# EAGLE design z8530-rs422-b (EAGLE 9.2.2)
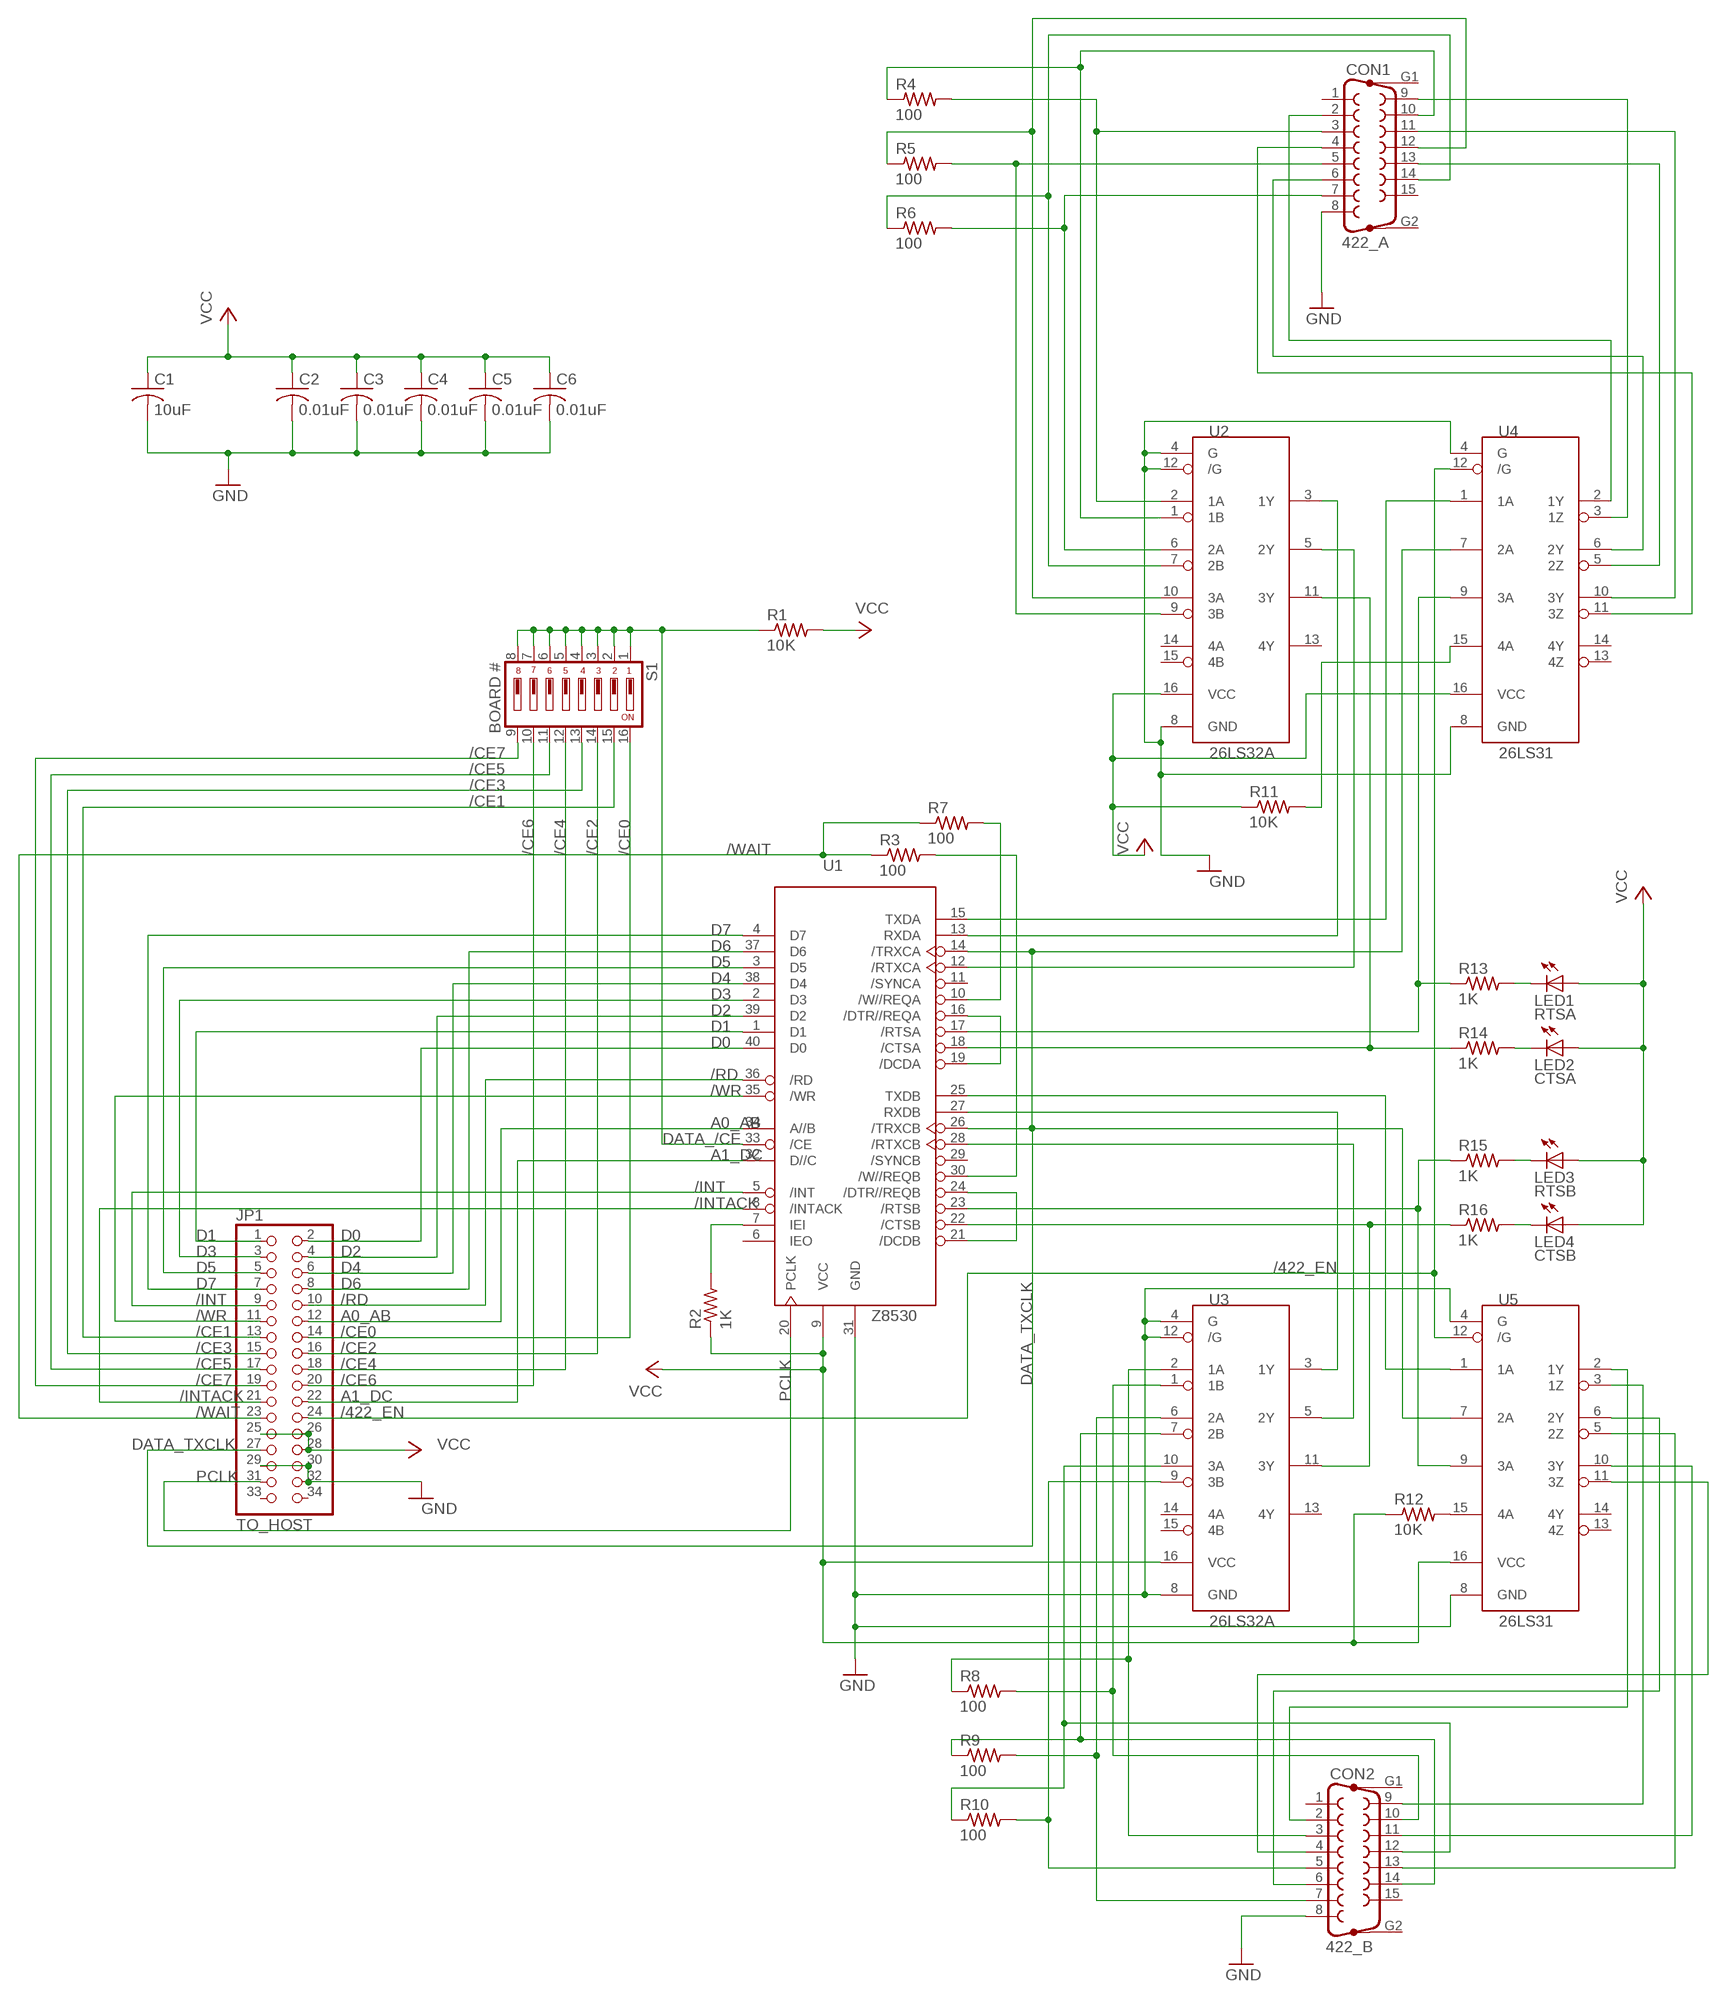
[diagram p0: schematic, sheet 1]

## Parts
C1  10uF  C-USC0805  [C0805]
C2  0.01uF  C-USC0805  [C0805]
C3  0.01uF  C-USC0805  [C0805]
C4  0.01uF  C-USC0805  [C0805]
C5  0.01uF  C-USC0805  [C0805]
C6  0.01uF  C-USC0805  [C0805]
CON1  422_A  F15VP  [F15VP]
CON2  422_B  F15VP  [F15VP]
JP1  TO_HOST  PINHD-2X17  [2X17]
LED1  RTSA  LED3MM  [LED3MM]
LED2  CTSA  LED3MM  [LED3MM]
LED3  RTSB  LED3MM  [LED3MM]
LED4  CTSB  LED3MM  [LED3MM]
R1  10K  R-US_R0805  [R0805]
R2  1K  R-US_R0805  [R0805]
R3  100  R-US_R0805  [R0805]
R4  100  R-US_R0805  [R0805]
R5  100  R-US_R0805  [R0805]
R6  100  R-US_R0805  [R0805]
R7  100  R-US_R0805  [R0805]
R8  100  R-US_R0805  [R0805]
R9  100  R-US_R0805  [R0805]
R10  100  R-US_R0805  [R0805]
R11  10K  R-US_R0805  [R0805]
R12  10K  R-US_R0805  [R0805]
R13  1K  R-US_R0805  [R0805]
R14  1K  R-US_R0805  [R0805]
R15  1K  R-US_R0805  [R0805]
R16  1K  R-US_R0805  [R0805]
S1  BOARD #  DP08  [DP-08]
U1  Z8530  Z8530PDIP40  [DIL40]
U2  26LS32A  AM26LS32APDIP16  [DIP16]
U3  26LS32A  AM26LS32APDIP16  [DIP16]
U4  26LS31  AM26L31  [DIP16]
U5  26LS31  AM26L31  [DIP16]

## Nets
/422_EN: JP1.24 U4.12(/G) U5.12(/G)
/CE0: JP1.14 S1.16
/CE1: JP1.13 S1.15
/CE2: JP1.16 S1.14
/CE3: JP1.15 S1.13
/CE4: JP1.18 S1.12
/CE5: JP1.17 S1.11
/CE6: JP1.20 S1.10
/CE7: JP1.19 S1.9
/INT: JP1.9 U1.5(/INT)
/INTACK: JP1.21 U1.8(/INTACK)
/RD: JP1.10 U1.36(/RD)
/WAIT: JP1.23 R3.1 R7.1
/WR: JP1.11 U1.35(/WR)
A0_AB: JP1.12 U1.34(A//B)
A1_DC: JP1.22 U1.32(D//C)
D0: JP1.2 U1.40(D0)
D1: JP1.1 U1.1(D1)
D2: JP1.4 U1.39(D2)
D3: JP1.3 U1.2(D3)
D4: JP1.6 U1.38(D4)
D5: JP1.5 U1.3(D5)
D6: JP1.8 U1.37(D6)
D7: JP1.7 U1.4(D7)
DATA_/CE: R1.1 S1.1 S1.2 S1.3 S1.4 S1.5 S1.6 S1.7 S1.8 U1.33(/CE)
DATA_TXCLK: JP1.27 U1.14(/TRXCA) U1.26(/TRXCB) U4.7(2A) U5.7(2A)
GND [gnd]: C1.2 C2.2 C3.2 C4.2 C5.2 C6.2 CON1.8 CON2.8 JP1.29 JP1.30 JP1.32 U1.31(GND) U2.4(G) U2.8(GND) U2.12(/G) U3.4(G) U3.8(GND) U3.12(/G) U4.4(G) U4.8(GND) U5.4(G) U5.8(GND)
N$7: R7.2 U1.10(/W//REQA)
N$8: R3.2 U1.30(/W//REQB)
N$11: U1.13(RXDA) U2.3(1Y)
N$12: U1.12(/RTXCA) U2.5(2Y)
N$13: R14.1 U1.18(/CTSA) U2.11(3Y)
N$14: U1.15(TXDA) U4.1(1A)
N$16: R13.1 U1.17(/RTSA) U4.9(3A)
N$17: U1.16(/DTR//REQA) U1.19(/DCDA)
N$18: U1.21(/DCDB) U1.24(/DTR//REQB)
N$19: U1.27(RXDB) U3.3(1Y)
N$20: U1.28(/RTXCB) U3.5(2Y)
N$21: R16.1 U1.22(/CTSB) U3.11(3Y)
N$22: U1.25(TXDB) U5.1(1A)
N$24: R15.1 U1.23(/RTSB) U5.9(3A)
N$26: CON1.3 R4.2 U2.2(1A)
N$27: CON1.10 R4.1 U2.1(1B)
N$28: CON1.7 R6.2 U2.6(2A)
N$29: CON1.14 R6.1 U2.7(2B)
N$30: CON1.12 R5.1 U2.10(3A)
N$31: CON1.5 R5.2 U2.9(3B)
N$32: CON1.2 U4.2(1Y)
N$33: CON1.9 U4.3(1Z)
N$34: CON1.6 U4.6(2Y)
N$35: CON1.13 U4.5(2Z)
N$36: CON1.11 U4.10(3Y)
N$37: CON1.4 U4.11(3Z)
N$40: CON2.3 R8.1 U3.2(1A)
N$41: CON2.10 R8.2 U3.1(1B)
N$42: CON2.7 R9.2 U3.6(2A)
N$43: CON2.14 R9.1 U3.7(2B)
N$44: CON2.12 R10.1 U3.10(3A)
N$45: CON2.5 R10.2 U3.9(3B)
N$46: CON2.2 U5.2(1Y)
N$47: CON2.9 U5.3(1Z)
N$48: CON2.6 U5.6(2Y)
N$49: CON2.13 U5.5(2Z)
N$50: CON2.11 U5.10(3Y)
N$51: CON2.4 U5.11(3Z)
N$56: LED1.K(C) R13.2
N$57: LED3.K(C) R15.2
N$58: LED2.K(C) R14.2
N$59: LED4.K(C) R16.2
N$60: R2.2 U1.7(IEI)
N$62: R11.2 U4.15(4A)
N$63: R12.2 U5.15(4A)
PCLK: JP1.31 U1.20(PCLK)
VCC [5Vpwr]: C1.1 C2.1 C3.1 C4.1 C5.1 C6.1 JP1.25 JP1.26 JP1.28 LED1.A LED2.A LED3.A LED4.A R1.2 R2.1 R11.1 R12.1 U1.9(VCC) U2.16(VCC) U3.16(VCC) U4.16(VCC) U5.16(VCC)
Unconnected: CON1.1 CON1.15 CON1.G1 CON1.G2 CON2.1 CON2.15 CON2.G1 CON2.G2 JP1.33 JP1.34 U1.6(IEO) U1.11(/SYNCA) U1.29(/SYNCB) U2.13(4Y) U2.14(4A) U2.15(4B) U3.13(4Y) U3.14(4A) U3.15(4B) U4.13(4Z) U4.14(4Y) U5.13(4Z) U5.14(4Y)

## Library data of the parts
C1-C6 = rcl:C-US: CAPACITOR, American symbol; SPICEPREFIX: C
CON1 CON2 = con-subd:F15VP: SUB-D; OC_FARNELL: unknown; OC_NEWARK: unknown
JP1 = pinhead:PINHD-2X17: PIN HEADER
LED1-LED4 = led:LED: LED OSRAM: - CHIPLED LG R971, LG N971, LY N971, LG Q971, LY Q971, LO R971, LY R971 LH N974, LH R974 LS Q976, LO Q976, LY Q976 LO Q996 - Hyper CHIPLED LW Q18S LB Q993, LB Q99A, LB R99A - SideLED LS A670, LO A670, LY A670, LG A670, LP A670 LB A673, LV A673, LT A673, LW A673 LH A674 LY A675 LS A676, LA A676, LO A676, LY A676, LW A676 LS A679, LY A679, LG A679 - Hyper Micro SIDELED® LS Y876, LA Y876, LO Y876, LY Y876 LT Y87S - SmartLED LW L88C, LW L88S LB L89C, LB L89S, LG L890 LS L89K, LO L89K, LY L89K LS L896, LA L896, LO L896, LY L896 - TOPLED LS T670, LO T670, LY T670, LG T670, LP T670 LSG T670, LSP T670, LSY T670, LOP T670, LYG T670 LG T671, LOG T671, LSG T671 LB T673, LV T673, LT T673, LW T673 LH T674 LS T676, LA T676, LO T676, LY T676, LB T676, LH T676, LSB T676, LW T676 LB T67C, LV T67C, LT T67C, LS T67K, LO T67K, LY T67K, LW E67C LS E67B, LA E67B, LO E67B, LY E67B, LB E67C, LV E67C, LT E67C LW T67C LS T679, LY T679, LG T679 LS T770, LO T770, LY T770, LG T770, LP T770 LB T773, LV T773, LT T773, LW T773 LH T774 LS E675, LA E675, LY E675, LS T675 LS T776, LA T776, LO T776, LY T776, LB T776 LHGB T686 LT T68C, LB T68C - Hyper Mini TOPLED® LB M676 - Mini TOPLED Santana® LG M470 LS M47K, LO M47K, LY M47K Source: http://www.osram.convergy.de LUXEON: - LUMILED® LXK2-PW12-R00, LXK2-PW12-S00, LXK2-PW14-U00, LXK2-PW14-V00 LXK2-PM12-R00, LXK2-PM12-S00, LXK2-PM14-U00 LXK2-PE12-Q00, LXK2-PE12-R00, LXK2-PE12-S00, LXK2-PE14-T00, LXK2-PE14-U00 LXK2-PB12-K00, LXK2-PB12-L00, LXK2-PB12-M00, LXK2-PB14-N00, LXK2-PB14-P00, LXK2-PB14-Q00 LXK2-PR12-L00, LXK2-PR12-M00, LXK2-PR14-Q00, LXK2-PR14-R00 LXK2-PD12-Q00, LXK2-PD12-R00, LXK2-PD12-S00 LXK2-PH12-R00, LXK2-PH12-S00 LXK2-PL12-P00, LXK2-PL12-Q00, LXK2-PL12-R00 Source: www.luxeon.com KINGBRIGHT: KA-3528ASYC Source: www.kingbright.com
R1-R16 = rcl:R-US_: RESISTOR, American symbol; SPICEPREFIX: R
S1 = switch-dil:DP08: DIL/CODE SWITCH; MPN: DP08; OC_FARNELL: 9471626; OC_NEWARK: 73J0035
U1 = rs422-stuff:Z85*30: Zilog SCC Serial Controller, dual port Synchronous/Asynchronous controller. Data sheet and User manual
U2 U3 = rs422-stuff:AM26LS32A: Texas Instruments Quadruple RS-422/423 Differential Line Receivers Data sheet
U4 U5 = rs422-stuff:AM26L31: Texas Instruments RS-422/423 AM26LS31x Quadruple Differential Line Driver Data sheet

## Net classes
0 default: width 0.254 mm, clearance 0.254 mm
1 3Vpwr: width 0.305 mm, clearance 0.254 mm
2 5Vpwr: width 0.406 mm, clearance 0.254 mm
3 gnd: width 0.508 mm, clearance 0.254 mm

## Board
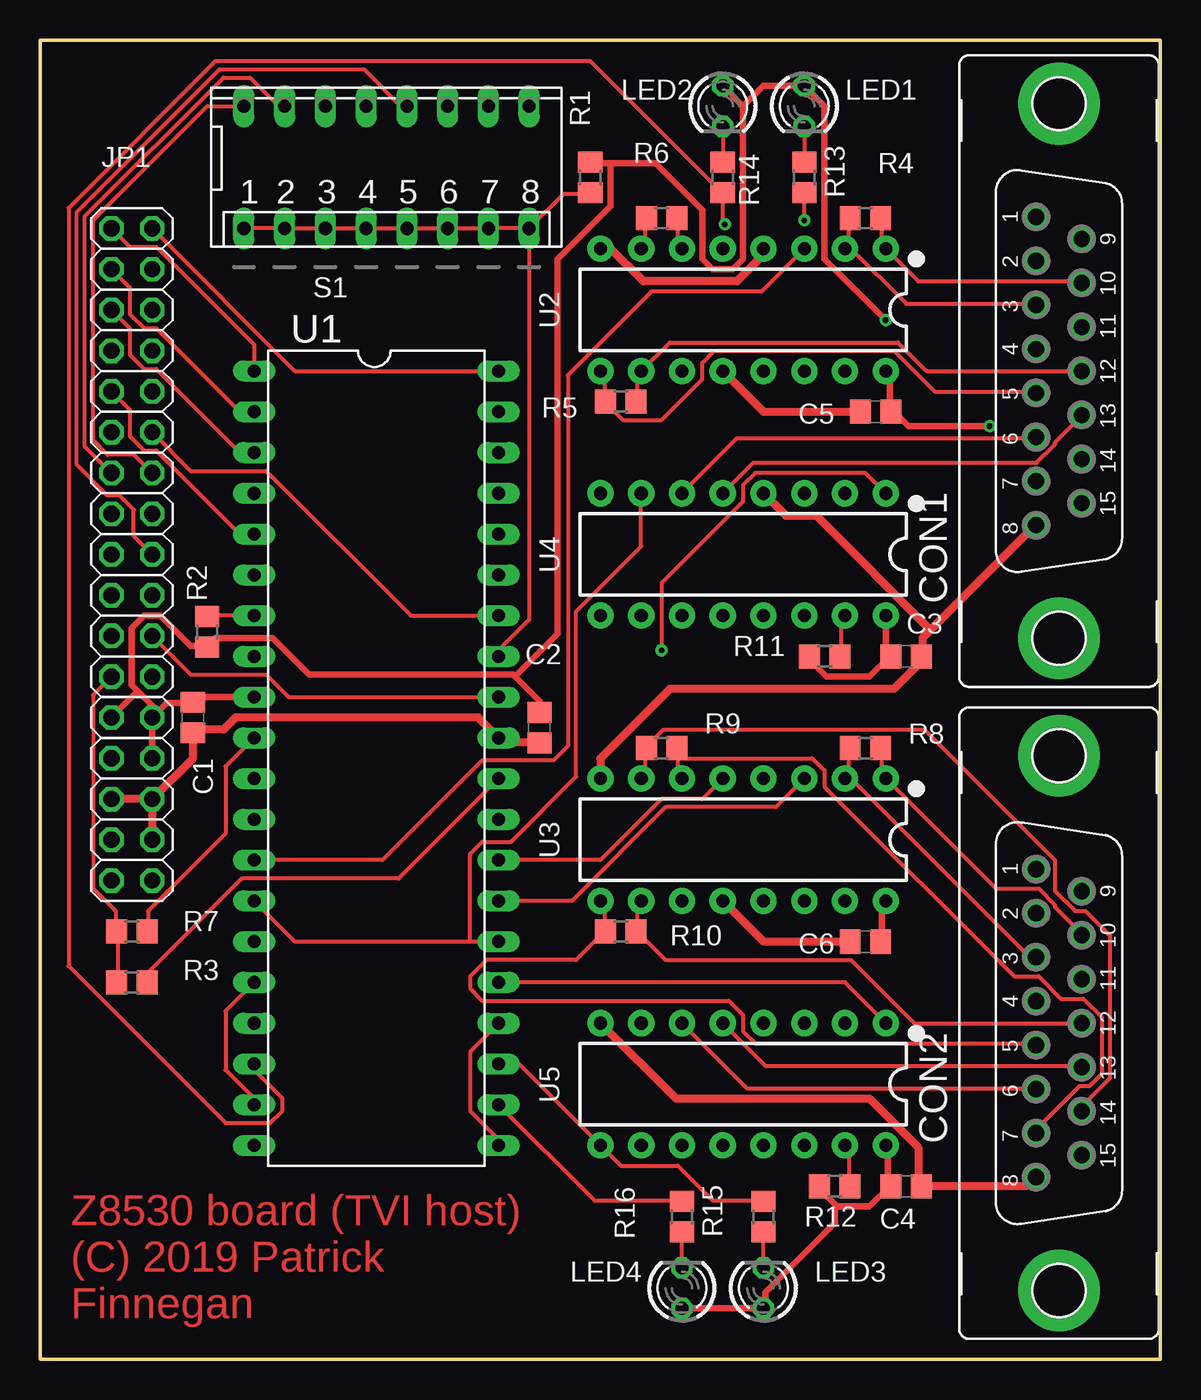
[diagram p1: board, top side]
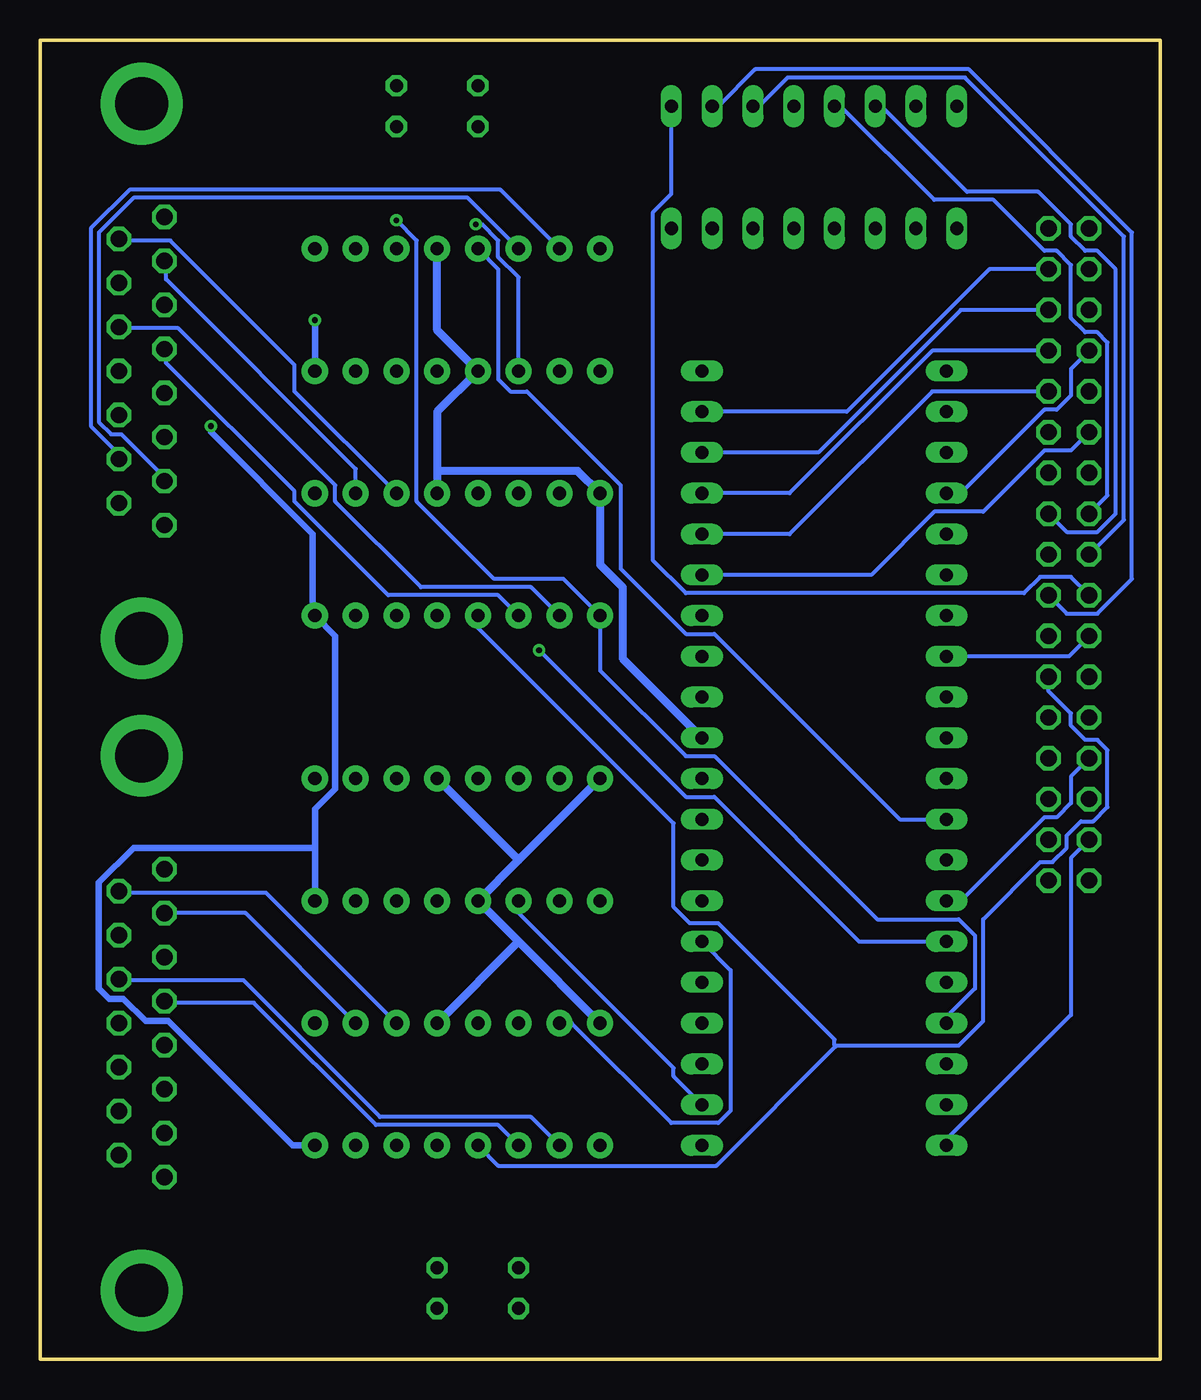
[diagram p2: board, bottom side, seen from below]

Size 69.83 x 82.22 mm. Coordinates in mm from the lower left corner, seen from the top.
Outline: 0,0 69.83,0 69.83,82.22 0,82.22 0,0
Copper layers (1*16): Top 0.035mm / dielectric 1.5mm / Bottom 0.035mm
Design rules "8mil": minimum track width 6mil, minimum drill 0.35mm, track to track 8mil, track to pad 8mil, pad to pad 8mil, via to via 8mil, smd to smd 8mil, copper to edge 40mil, drill to drill 6mil, minimum pad ring 10mil, minimum via ring 8mil, stop-mask expansion 4mil, vias tented up to drill 0mil, thermal gap 10mil

### Footprints (pad centres in the part's own frame; a part is rotated, then mirrored left to right if it is on the bottom)
C0805 = smd 1.3 x 1.5: 1 -0.95,0; 2 0.95,0
F15VP = drill 1.016 octagon: 1 9.601,1.422; 2 6.858,1.422; 3 4.115,1.422; 4 1.372,1.422; 5 -1.372,1.422; 6 -4.115,1.422; 7 -6.858,1.422; 8 -9.601,1.422; 9 8.23,-1.422; 10 5.486,-1.422; 11 2.743,-1.422; 12 0,-1.422; 13 -2.743,-1.422; 14 -5.486,-1.422; 15 -8.23,-1.422 | drill 3.302 pad 5.08: G1 -16.662,0; G2 16.662,0
2X17 = drill 1.016 octagon: 1 -20.32,-1.27; 2 -20.32,1.27; 3 -17.78,-1.27; 4 -17.78,1.27; 5 -15.24,-1.27; 6 -15.24,1.27; 7 -12.7,-1.27; 8 -12.7,1.27; 9 -10.16,-1.27; 10 -10.16,1.27; 11 -7.62,-1.27; 12 -7.62,1.27; 13 -5.08,-1.27; 14 -5.08,1.27; 15 -2.54,-1.27; 16 -2.54,1.27; 17 0,-1.27; 18 0,1.27; 19 2.54,-1.27; 20 2.54,1.27; 21 5.08,-1.27; 22 5.08,1.27; 23 7.62,-1.27; 24 7.62,1.27; 25 10.16,-1.27; 26 10.16,1.27; 27 12.7,-1.27; 28 12.7,1.27; 29 15.24,-1.27; 30 15.24,1.27; 31 17.78,-1.27; 32 17.78,1.27; 33 20.32,-1.27; 34 20.32,1.27
LED3MM = drill 0.813 octagon: A -1.27,0; K 1.27,0
R0805 = smd 1.3 x 1.5: 1 -0.95,0; 2 0.95,0
DP-08 = drill 0.813 long: 1 -8.89,-3.81; 2 -6.35,-3.81; 3 -3.81,-3.81; 4 -1.27,-3.81; 5 1.27,-3.81; 6 3.81,-3.81; 7 6.35,-3.81; 8 8.89,-3.81; 9 8.89,3.81; 10 6.35,3.81; 11 3.81,3.81; 12 1.27,3.81; 13 -1.27,3.81; 14 -3.81,3.81; 15 -6.35,3.81; 16 -8.89,3.81
DIL40 = drill 0.813 long: 1 -24.13,-7.62; 2 -21.59,-7.62; 3 -19.05,-7.62; 4 -16.51,-7.62; 5 -13.97,-7.62; 6 -11.43,-7.62; 7 -8.89,-7.62; 8 -6.35,-7.62; 9 -3.81,-7.62; 10 -1.27,-7.62; 11 1.27,-7.62; 12 3.81,-7.62; 13 6.35,-7.62; 14 8.89,-7.62; 15 11.43,-7.62; 16 13.97,-7.62; 17 16.51,-7.62; 18 19.05,-7.62; 19 21.59,-7.62; 20 24.13,-7.62; 21 24.13,7.62; 22 21.59,7.62; 23 19.05,7.62; 24 16.51,7.62; 25 13.97,7.62; 26 11.43,7.62; 27 8.89,7.62; 28 6.35,7.62; 29 3.81,7.62; 30 1.27,7.62; 31 -1.27,7.62; 32 -3.81,7.62; 33 -6.35,7.62; 34 -8.89,7.62; 35 -11.43,7.62; 36 -13.97,7.62; 37 -16.51,7.62; 38 -19.05,7.62; 39 -21.59,7.62; 40 -24.13,7.62
DIP16 = drill 0.813 pad 1.626: 1 -8.89,-3.81; 2 -6.35,-3.81; 3 -3.81,-3.81; 4 -1.27,-3.81; 5 1.27,-3.81; 6 3.81,-3.81; 7 6.35,-3.81; 8 8.89,-3.81; 9 8.89,3.81; 10 6.35,3.81; 11 3.81,3.81; 12 1.27,3.81; 13 -1.27,3.81; 14 -3.81,3.81; 15 -6.35,3.81; 16 -8.89,3.81

### Placement (x,y rotation side)
C1  9.52,40 270 top
C2  31.11,39.37 270 top
C3  53.97,43.81 0 top
C4  53.97,10.79 0 top
C5  52.07,59.05 180 top
C6  51.44,26.03 180 top
CON1  63.5,61.59 90 top
CON2  63.5,20.95 90 top
JP1  5.72,50.16 270 top
LED1  47.62,78.11 270 top
LED2  42.55,78.11 270 top
LED3  45.08,4.45 90 top
LED4  40,4.45 90 top
R1  34.29,73.66 90 top
R2  10.41,45.34 90 top
R3  5.72,23.49 0 top
R4  51.44,71.12 180 top
R5  36.19,59.69 180 top
R6  38.73,71.12 0 top
R7  5.72,26.67 0 top
R8  51.44,38.1 0 top
R9  38.73,38.1 0 top
R10  36.19,26.67 180 top
R11  48.89,43.81 0 top
R12  49.53,10.79 0 top
R13  47.62,73.66 90 top
R14  42.55,73.66 90 top
R15  45.08,8.89 270 top
R16  40,8.89 270 top
S1  21.59,74.3 0 top
U1  20.95,37.46 270 top
U2  43.81,65.41 180 top
U3  43.81,32.38 180 top
U4  43.81,50.16 180 top
U5  43.81,17.15 180 top

### Tracks (layer width: path | path; a pad name or v marks a point on that pad's centre or on a via)
/422_EN
  Bottom 0.254: JP1.24 6.98,41.66 5.59,40.26 5.59,39.5 4.7,38.61 3.94,38.61 3.3,37.97 3.3,34.42 4.19,33.53 4.95,33.53 5.84,32.64 5.84,31.88 6.73,30.99 7.49,30.99 11.05,27.43 11.05,21.08 12.57,19.56 20.19,19.56 20.26,19.49 | 20.26,19.49 27.69,12.06 41.28,12.06 U5.12 | U4.12 42.55,45.59 30.35,33.4 30.35,28.19 29.34,27.18 27.56,27.18 20.32,19.94 20.32,19.56 20.26,19.49
/CE0
  Top 0.254: S1.16 10.41,78.11 3.3,70.99 3.3,57.28 4.19,56.39 5.84,56.39 JP1.14
/CE1
  Top 0.254: S1.15 14.86,78.11 13.08,79.88 11.43,79.88 2.79,71.25 2.79,56.9 JP1.13
/CE2
  Bottom 0.254: S1.14 17.4,78.11 12.06,72.77 7.62,72.77 5.59,70.74 5.59,69.98 4.7,69.09 3.94,69.09 2.79,67.94 2.79,52.7 3.94,51.56 5.84,51.56 JP1.16
/CE3
  Bottom 0.254: S1.13 19.94,78.11 14.1,72.26 10.41,72.26 7.24,69.09 6.48,69.09 5.59,68.2 5.59,64.9 4.7,64.01 3.94,64.01 3.3,63.37 3.3,53.85 JP1.15
/CE4
  Top 0.254: S1.12 22.48,78.11 20.19,80.39 11.18,80.39 2.29,71.5 2.29,55.75 4.19,53.85 4.95,53.85 5.84,52.96 5.84,51.31 JP1.18
/CE5
  Bottom 0.254: S1.11 25.02,78.11 23.24,79.88 12.19,79.88 2.29,69.98 2.29,52.32 JP1.17
/CE6
  Bottom 0.254: S1.10 27.56,78.11 25.27,80.39 11.94,80.39 1.78,70.23 1.78,48.64 3.94,46.48 5.84,46.48 JP1.20
/CE7
  Bottom 0.254: S1.9 30.48,72.64 31.62,71.5 31.62,49.78 29.59,47.75 8.51,47.75 7.49,48.77 5.59,48.77 JP1.19
/INT
  Top 0.254: U1.5 12.45,51.43 7.24,56.64 6.48,56.64 5.59,57.53 5.59,59.18 JP1.9
/INTACK
  Bottom 0.254: U1.8 5.72,43.81 JP1.21
/RD
  Bottom 0.254: U1.36 23.11,51.43 14.22,60.33 JP1.10
/WAIT
  Top 0.254: R3.1 4.83,23.49 4.83,26.67 R7.1 4.7,26.67 4.7,27.94 3.3,29.34 3.3,41.4 JP1.23
/WR
  Bottom 0.254: U1.35 18.03,48.89 14.1,52.83 11.05,52.83 7.24,56.64 5.59,56.64 JP1.11
A0_AB
  Top 0.254: U1.34 23.11,46.35 14.1,55.37 9.4,55.37 JP1.12
A1_DC
  Top 0.254: U1.32 15.49,41.27 14.1,42.67 9.4,42.67 JP1.22
D0
  Top 0.254: U1.40 15.88,61.59 JP1.2
D1
  Top 0.254: U1.1 13.34,63.25 7.24,69.34 5.59,69.34 JP1.1
D2
  Bottom 0.254: U1.39 19.56,59.05 10.67,67.94 JP1.4
D3
  Top 0.254: U1.2 12.45,59.05 7.24,64.26 6.48,64.26 5.59,65.15 5.59,66.8 JP1.3
D4
  Bottom 0.254: U1.38 21.34,56.52 12.45,65.41 JP1.6
D5
  Top 0.254: U1.3 12.45,56.52 7.24,61.72 6.48,61.72 5.59,62.61 5.59,64.26 JP1.5
D6
  Bottom 0.254: U1.37 23.11,53.97 14.22,62.86 JP1.8
D7
  Bottom 0.254: U1.4 12.45,53.97 7.24,59.18 6.48,59.18 5.59,60.07 5.59,61.72 JP1.7
DATA_/CE
  Top 0.254: S1.1 S1.2 S1.3 S1.4 S1.5 S1.6 S1.7 S1.8 | S1.8 32.64,72.64 34.29,72.64 R1.1 | U1.33 28.58,44.2 30.48,46.1 S1.8
DATA_TXCLK
  Top 0.254: 26.8,26.03 15.88,26.03 U1.14 | 26.8,26.03 U1.26 | U4.7 37.47,50.67 33.4,46.61 33.4,36.32 29.34,32.26 27.56,32.26 26.8,31.5 26.8,26.03
  Bottom 0.254: U1.14 12.45,28.57 7.24,33.78 6.48,33.78 5.59,34.67 5.59,36.32 JP1.27 | U5.7 36.7,20.95 30.48,14.73 27.56,14.73 26.8,15.49 26.8,24.26 U1.26
GND
  Top 0.508: CON2.8 61.98,11.3 61.47,10.79 C4.2 54.74,10.92 54.74,13.21 51.69,16.26 39.62,16.26 U5.8 | C6.2 45.08,26.03 U3.12 | 55.5,45.47 61.98,51.94 CON1.8 | 55.5,45.47 54.99,44.96 54.99,43.81 C3.2 54.74,43.69 54.74,43.31 53.21,41.78 39.24,41.78 34.92,37.46 U3.8 | U2.8 35.56,69.22 37.59,67.18 43.43,67.18 45.08,68.83 U2.4 | C5.2 45.08,59.05 U2.12 | 55.5,45.47 48.39,52.58 46.48,52.58 U4.4 | JP1.30 9.52,37.46 C1.2 9.65,39.24 11.43,39.24 12.19,40 27.31,40 U1.31 28.83,38.48 31.11,38.48 C2.2 | JP1.30 JP1.32 | JP1.30 JP1.29
  Bottom 0.508: 40,26.03 U3.12 40,31.11 | 40,26.03 U5.8 | 40,31.11 U3.8 | 40,26.03 U5.4 | 40,31.11 U3.4 | 45.08,55.37 45.08,59.05 U2.12 45.08,64.14 U2.4 | 45.08,55.37 U4.4 | U1.31 33.53,43.69 33.53,48.13 34.92,49.53 U4.8 36.32,55.37 45.08,55.37
N$7
  Top 0.254: U1.10 11.56,36.96 11.56,32.77 6.73,27.94 6.73,26.67 R7.2
N$8
  Top 0.254: U1.30 22.35,29.97 12.57,29.97 6.73,24.13 6.73,23.49 R3.2
N$11
  Top 0.254: U1.13 21.34,31.11 27.56,37.34 32,37.34 32.89,38.23 32.89,61.34 38.1,66.55 44.96,66.55 U2.3
N$12
  Bottom 0.254: U1.12 16.26,33.66 27.81,45.21 29.59,45.21 33.66,49.28 33.66,54.48 39.5,60.33 40.51,60.33 41.28,61.09 41.28,67.94 U2.5
N$13  (via drill 0.35)
  Top 0.254: 42.55,72.64 42.55,70.87 v42.67,70.74 | U1.18 13.34,18.03 15.11,16.26 15.11,15.49 14.35,14.73 11.56,14.73 1.78,24.51 1.78,71.75 10.92,80.9 34.29,80.9 42.55,72.64 | 42.55,72.64 R14.1
  Bottom 0.254: v42.67,70.74 42.29,70.74 41.28,69.72 41.28,68.71 40,67.44 U2.11
N$14  (via drill 0.35)
  Top 0.254: v38.73,44.2 38.73,48.39 43.81,53.47 43.81,54.48 44.58,55.25 51.44,55.25 U4.1
  Bottom 0.254: U1.15 18.8,26.03 27.81,35.05 29.59,35.05 v38.73,44.2
N$16  (via drill 0.35)
  Top 0.254: v47.62,70.99 R13.1
  Bottom 0.254: v47.62,70.99 46.36,69.72 46.36,53.47 41.53,48.64 37.21,48.64 U4.9 34.92,42.93 29.59,37.59 27.81,37.59 17.65,27.43 12.57,27.43 11.56,26.42 11.56,23.11 13.34,21.34 U1.17
N$17
  Top 0.254: U1.19 13.34,16.26 11.56,18.03 11.56,21.72 U1.16
N$18
  Top 0.254: U1.21 28.58,13.72 26.8,15.49 26.8,19.18 U1.24
N$19
  Top 0.254: U1.27 33.15,28.57 38.99,34.42 45.85,34.42 U3.3
N$20
  Top 0.254: U1.28 34.92,31.11 38.73,34.92 41.28,34.92 U3.5
N$21
  Top 0.254: U1.22 34.54,9.91 40,9.91 R16.1
  Bottom 0.254: U3.11 40,27.81 30.35,18.16 30.35,17.65 U1.22
N$22
  Top 0.254: U1.25 50.17,23.49 U5.1
N$24
  Top 0.254: R15.1 45.08,9.91 41.91,9.91 39.75,12.06 36.19,12.06 U5.9 29.84,18.41 U1.23
N$26
  Top 0.254: R4.2 50.42,71.12 50.42,69.47 U2.2 50.42,69.34 53.97,65.79 61.98,65.79 CON1.3
N$27
  Top 0.254: R4.1 52.45,71.12 52.45,69.47 U2.1 54.74,67.18 64.9,67.18 CON1.10
N$28
  Top 0.254: U2.6 39.75,69.47 39.75,71.12 R6.2
  Bottom 0.254: U2.6 43.18,72.39 64.01,72.39 66.17,70.23 66.17,58.42 65.41,57.66 64.77,57.66 62.1,54.99 62.1,54.74 CON1.7
N$29
  Top 0.254: U2.7 37.72,69.47 37.72,71.12 R6.1
  Bottom 0.254: U2.7 41.15,72.9 64.26,72.9 66.67,70.48 66.67,58.17 65.02,56.52 65.02,56.13 CON1.14
N$30
  Top 0.254: R5.1 37.21,59.69 37.21,61.34 U2.10 39.24,63.37 53.47,63.37 55.25,61.59 CON1.12
N$31
  Top 0.254: 35.18,59.69 35.18,61.34 U2.9 | 35.18,59.69 36.32,58.55 38.73,58.55 41.28,61.09 41.28,62.1 42.04,62.86 53.21,62.86 55.75,60.33 61.98,60.33 CON1.5 | 35.18,59.69 R5.2
N$32
  Bottom 0.254: U4.2 50.17,55.5 61.98,67.31 61.98,68.45 CON1.2
N$33
  Bottom 0.254: U4.3 53.97,60.33 53.97,61.98 61.72,69.72 64.9,69.72 CON1.9
N$34
  Top 0.254: U4.6 43.43,57.4 61.98,57.4 CON1.6
N$35
  Top 0.254: U4.5 44.45,55.88 62.1,55.88 63.25,57.02 63.25,57.15 64.9,58.8 CON1.13
N$36
  Bottom 0.254: U4.10 39.24,48.13 46.1,48.13 51.44,53.47 51.44,54.48 61.21,64.26 64.9,64.26 CON1.11
N$37
  Bottom 0.254: U4.11 41.28,47.62 48.13,47.62 53.97,53.47 53.97,54.1 61.98,62.1 61.98,62.86 CON1.4
N$40
  Top 0.254: R8.1 50.42,38.1 50.42,36.45 U3.2 50.42,36.32 61.59,25.15 61.98,25.15 CON2.3
N$41
  Top 0.254: R8.2 52.45,38.1 52.45,36.45 U3.1 59.56,29.34 62.23,29.34 63.25,28.32 63.25,28.19 64.9,26.54 CON2.10
N$42
  Top 0.254: 39.75,37.46 39.75,36.45 U3.6 | 39.75,37.46 39.75,38.1 R9.2 39.75,37.46 | 39.75,37.46 48.13,37.46 48.89,36.7 48.89,35.69 60.71,23.88 62.23,23.88 63.63,22.48 65.02,22.48 66.17,21.34 66.17,17.78 65.41,17.02 64.77,17.02 62.1,14.35 62.1,14.1 CON2.7
N$43
  Top 0.254: 37.72,38.1 37.72,36.45 U3.7 | 37.72,38.1 38.86,39.24 55.12,39.24 63.25,31.11 63.25,29.21 64.52,27.94 65.15,27.94 66.67,26.42 66.67,17.53 65.02,15.88 65.02,15.49 CON2.14 | 37.72,38.1 R9.1
N$44
  Top 0.254: 37.21,26.67 37.21,28.32 U3.10 | CON2.12 54.48,20.95 50.55,24.89 38.99,24.89 37.21,26.67 | 37.21,26.67 R10.1
N$45
  Top 0.254: 35.18,26.67 35.18,28.32 U3.9 | 35.18,26.67 33.4,24.89 27.81,24.89 26.8,23.88 26.8,23.11 27.56,22.35 42.93,22.35 43.81,21.46 43.81,20.45 44.58,19.69 61.98,19.69 CON2.5 | 35.18,26.67 R10.2
N$46
  Bottom 0.254: CON2.2 57.02,27.81 U5.2
N$47
  Bottom 0.254: U5.3 55.75,29.08 64.9,29.08 CON2.9
N$48
  Top 0.254: U5.6 44.07,16.89 61.98,16.89 CON2.6
N$49
  Top 0.254: U5.5 45.21,18.29 64.9,18.29 CON2.13
N$50
  Bottom 0.254: U5.10 39.24,15.11 48.64,15.11 57.15,23.62 64.9,23.62 CON2.11
N$51
  Bottom 0.254: U5.11 41.28,14.6 48.89,14.6 56.52,22.23 61.98,22.23 CON2.4
N$56
  Top 0.254: LED1.K R13.2
N$57
  Top 0.254: LED3.K R15.2
N$58
  Top 0.254: LED2.K R14.2
N$59
  Top 0.254: LED4.K R16.2
N$60
  Top 0.254: U1.7 10.41,46.35 R2.2
N$62
  Top 0.254: U4.15 49.91,46.1 49.91,43.81 R11.2
N$63
  Top 0.254: U5.15 50.42,13.08 50.42,10.79 R12.2
PCLK
  Bottom 0.254: U1.20 13.34,13.72 5.59,21.46 5.59,31.24 JP1.31
VCC  (via drill 0.35)
  Top 0.406: LED4.A LED3.A 45.21,3.3 45.21,4.19 49.53,8.51 49.53,9.4 49.66,9.53 | 49.66,9.53 48.64,10.54 48.64,10.79 R12.1 | 49.66,9.53 51.69,9.53 52.96,10.79 C4.1 52.83,10.92 52.83,13.21 U5.16 | U3.16 52.45,28.32 52.45,26.03 C6.1 | R11.1 48.01,43.81 48.01,43.56 49.02,42.55 51.69,42.55 52.96,43.81 C3.1 52.7,43.81 U4.16 | JP1.26 7.87,40.89 9.52,40.89 C1.1 9.65,41.02 9.91,41.27 U1.9 | 6.1,41.66 7.24,40.51 JP1.26 | 6.1,41.66 5.72,42.04 5.72,45.59 6.48,46.35 7.49,46.35 9.4,44.45 10.41,44.45 R2.1 10.54,44.58 10.92,44.96 14.48,44.96 16.76,42.67 29.46,42.67 29.59,42.55 | C2.1 31.11,41.02 29.59,42.55 | JP1.26 JP1.28 | 6.1,41.66 JP1.25 | U2.16 52.96,61.34 52.96,59.05 C5.1 53.21,59.05 54.1,58.17 v59.18,58.17 | 35.56,74.55 38.35,74.55 41.28,71.63 41.28,68.58 41.91,67.94 43.18,67.94 43.81,68.58 43.81,78.11 | 35.56,74.55 34.29,74.55 R1.2 | LED2.A 43.81,78.11 | 43.81,78.11 45.08,79.38 LED1.A 48.89,78.11 48.89,68.58 v52.7,64.77 | 29.59,42.55 32.26,45.21 32.26,68.58 35.56,71.88 35.56,74.55
  Bottom 0.406: 52.7,31.88 52.7,34.29 51.44,35.56 51.44,45.09 U4.16 52.83,46.48 52.83,51.43 59.18,57.78 v59.18,58.17 | 52.7,31.88 U3.16 | U5.16 54.1,13.33 61.85,21.08 63.25,21.08 64.64,22.48 65.53,22.48 66.17,23.11 66.17,29.72 64.01,31.88 52.7,31.88 | v52.7,64.77 U2.16

### Text on the board
Top: Z8530 board (TVI host) / (C) 2019 Patrick / Finnegan